# EAGLE schematic pneumatic_control (EAGLE 7.4.0)
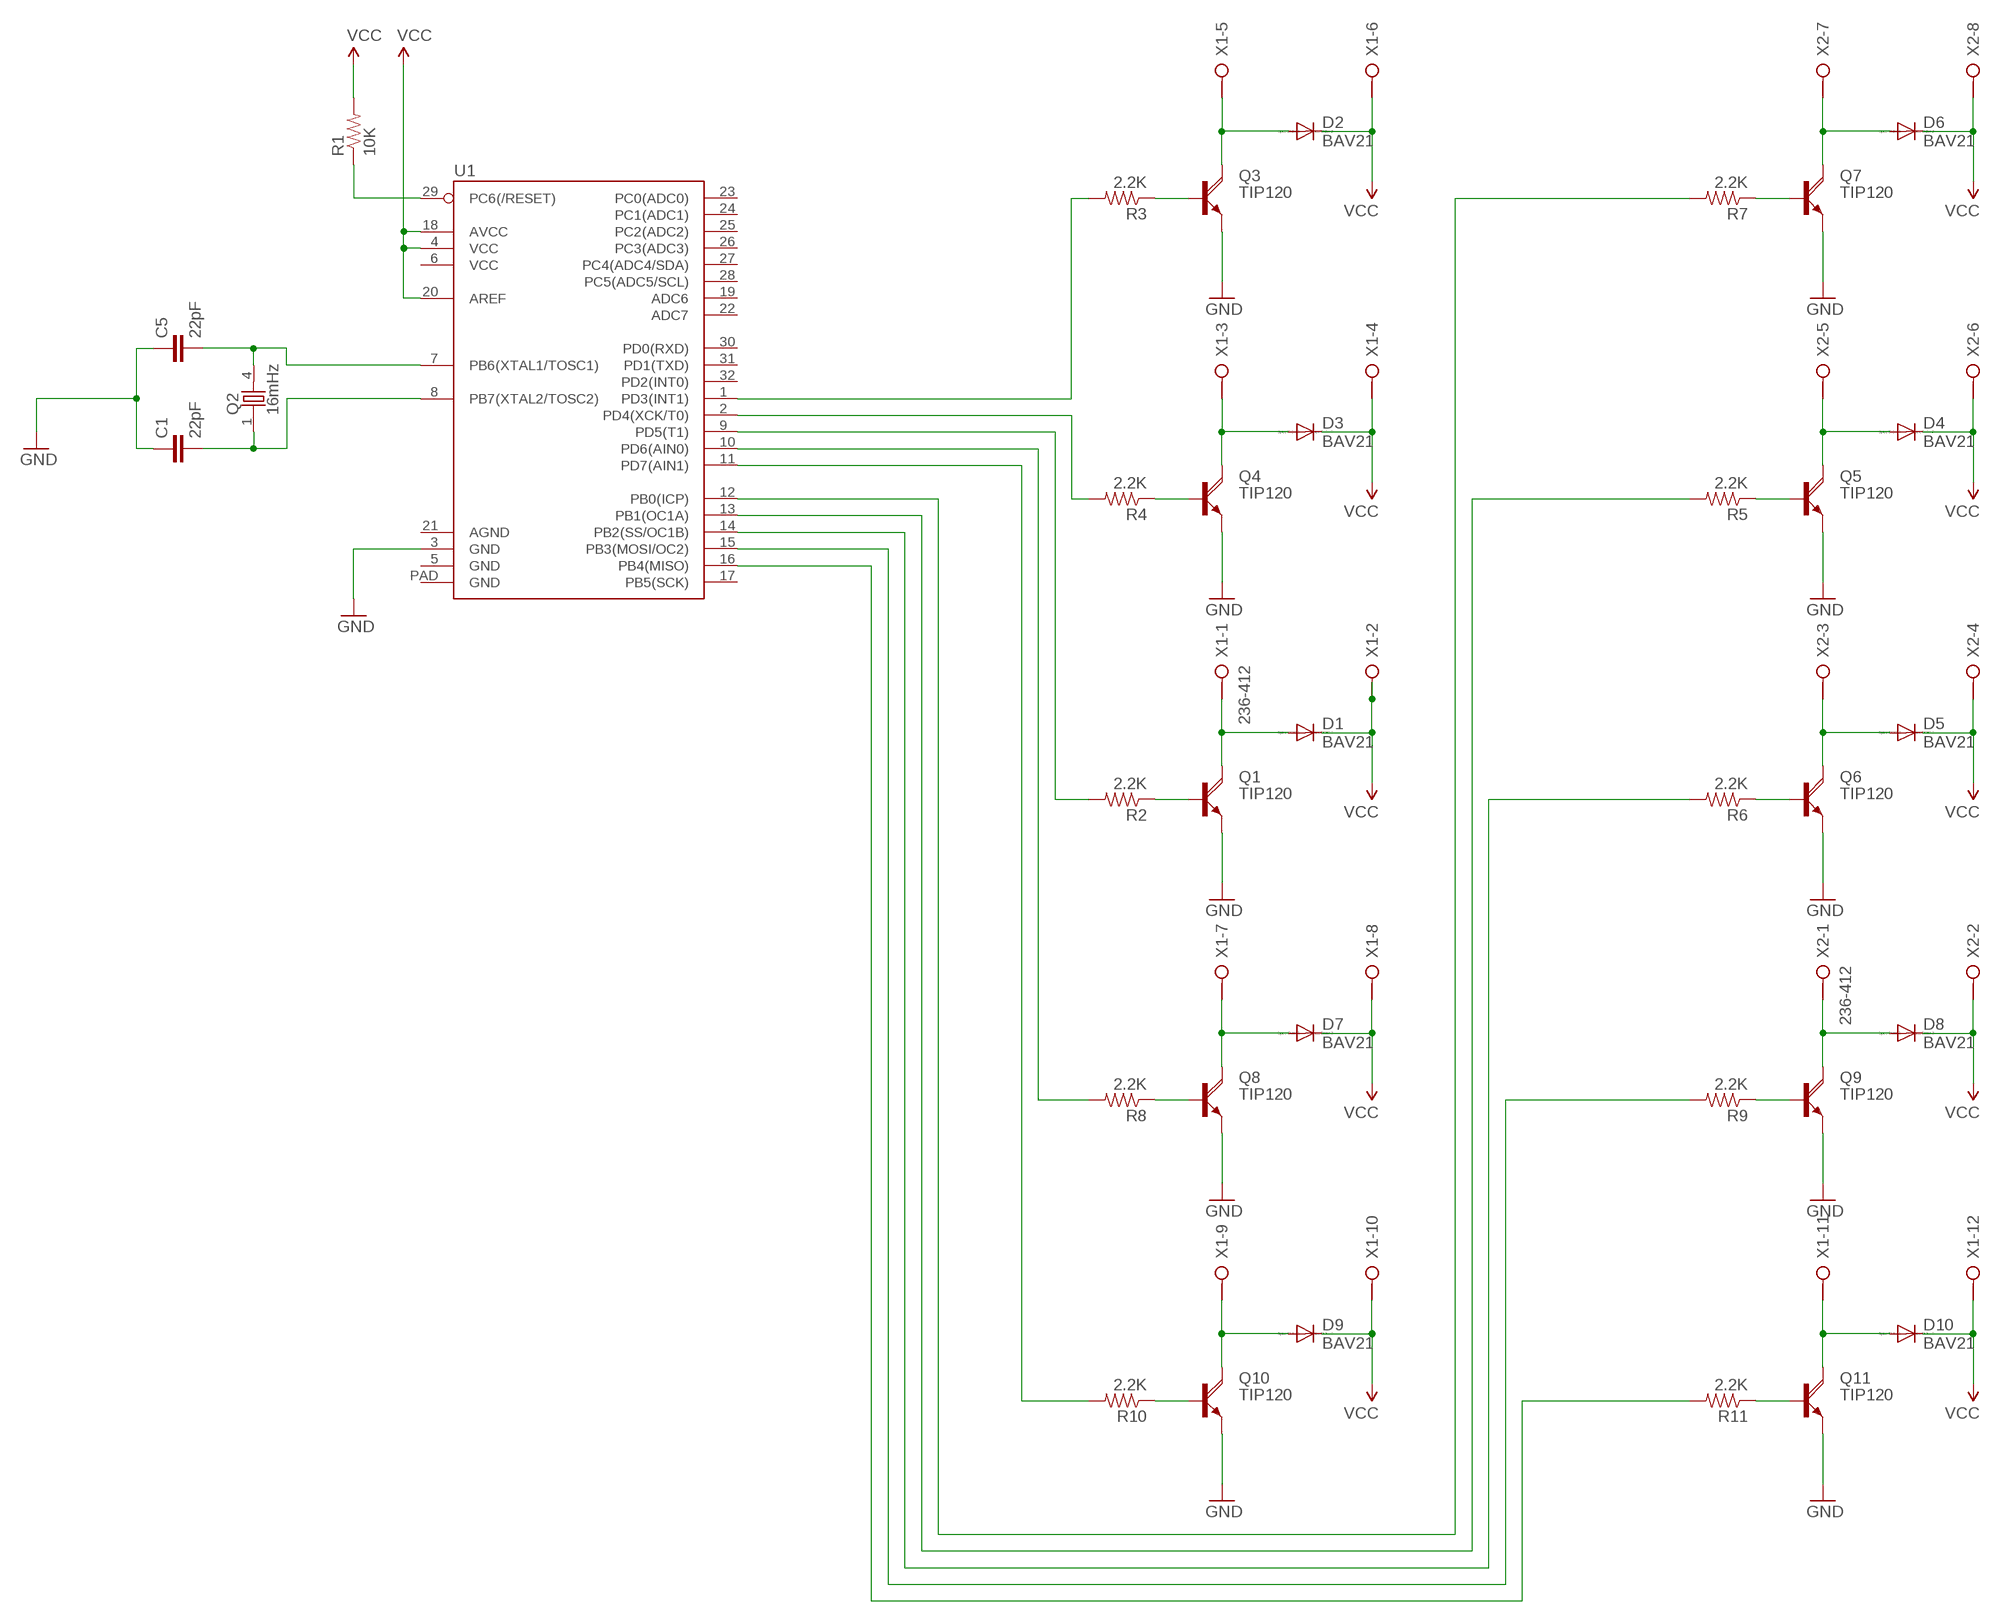
[diagram p0: schematic, sheet 1]

## Parts
C1  22pF  CAPPTH  [CAP-PTH-SMALL]
C5  22pF  CAPPTH  [CAP-PTH-SMALL]
D1  BAV21  [DO35-10]
D2  BAV21  [DO35-10]
D3  BAV21  [DO35-10]
D4  BAV21  [DO35-10]
D5  BAV21  [DO35-10]
D6  BAV21  [DO35-10]
D7  BAV21  [DO35-10]
D8  BAV21  [DO35-10]
D9  BAV21  [DO35-10]
D10  BAV21  [DO35-10]
Q1  TIP120  [TO220AH]
Q2  16mHz  86SMX  [86SMX]
Q3  TIP120  [TO220AH]
Q4  TIP120  [TO220AH]
Q5  TIP120  [TO220AH]
Q6  TIP120  [TO220AH]
Q7  TIP120  [TO220AH]
Q8  TIP120  [TO220AH]
Q9  TIP120  [TO220AH]
Q10  TIP120  [TO220AH]
Q11  TIP120  [TO220AH]
R1  10K  RESISTORPTH-1/4W  [AXIAL-0.4]
R2  2.2K  RESISTORPTH-1/4W  [AXIAL-0.4]
R3  2.2K  RESISTORPTH-1/4W  [AXIAL-0.4]
R4  2.2K  RESISTORPTH-1/4W  [AXIAL-0.4]
R5  2.2K  RESISTORPTH-1/4W  [AXIAL-0.4]
R6  2.2K  RESISTORPTH-1/4W  [AXIAL-0.4]
R7  2.2K  RESISTORPTH-1/4W  [AXIAL-0.4]
R8  2.2K  RESISTORPTH-1/4W  [AXIAL-0.4]
R9  2.2K  RESISTORPTH-1/4W  [AXIAL-0.4]
R10  2.2K  RESISTORPTH-1/4W  [AXIAL-0.4]
R11  2.2K  RESISTORPTH-1/4W  [AXIAL-0.4]
U1  ATMEGA328P_MLFMLF32  [MLF32-PAD]
X1  236-412  [236-412]
X2  236-412  [236-412]

## Nets
GND: C1.1 C5.1 Q1.E Q3.E Q4.E Q5.E Q6.E Q7.E Q8.E Q9.E Q10.E Q11.E U1.3(GND)
N$1: R1.P$1 U1.29(PC6(/RESET))
N$2: R2.P$2 U1.9(PD5(T1))
N$3: Q1.B R2.P$1
N$4: R3.P$2 U1.1(PD3(INT1))
N$5: Q3.B R3.P$1
N$6: R4.P$2 U1.2(PD4(XCK/T0))
N$7: Q4.B R4.P$1
N$9: Q5.B R5.P$1
N$10: R6.P$2 U1.14(PB2(SS/OC1B))
N$11: Q6.B R6.P$1
N$12: R7.P$2 U1.12(PB0(ICP))
N$13: Q7.B R7.P$1
N$14: C5.2 Q2.4
N$15: C1.2 Q2.1
N$16: R10.P$2 U1.11(PD7(AIN1))
N$17: Q8.B R8.P$1
N$18: R9.P$2 U1.15(PB3(MOSI/OC2))
N$19: Q9.B R9.P$1
N$21: Q10.B R10.P$1
N$22: R11.P$2 U1.16(PB4(MISO))
N$23: Q11.B R11.P$1
N$24: R8.P$2 U1.10(PD6(AIN0))
N$25: R5.P$2 U1.13(PB1(OC1A))
SNV(+): D1.A Q1.C X1.1@1(-1:KL1)
SNV(+)1: D2.A Q3.C X1.5@1(-5:KL1)
SNV(+)2: D3.A Q4.C X1.3@1(-3:KL1)
SNV(+)3: D4.A Q5.C X2.5@1(-5:KL1)
SNV(+)4: D5.A Q6.C X2.3@1(-3:KL1)
SNV(+)5: D6.A Q7.C X2.7@1(-7:KL1)
SNV(+)6: D7.A Q8.C X1.7@1(-7:KL1)
SNV(+)7: D8.A Q9.C X2.1@1(-1:KL1)
SNV(+)8: D9.A Q10.C X1.9@1(-9:KL1)
SNV(+)9: D10.A Q11.C X1.11@1(-11:KL1)
VCC: D1.C D2.C D3.C D4.C D5.C D6.C D7.C D8.C D9.C D10.C R1.P$2 U1.18(AVCC) U1.20(AREF) X1.2@1(-2:KL1) X1.2@2(-2:KL2) X1.4@1(-4:KL1) X1.6@1(-6:KL1) X1.8@1(-8:KL1) X1.10@1(-10:KL1) X1.12@1(-12:KL1) X2.2@1(-2:KL1) X2.4@1(-4:KL1) X2.6@1(-6:KL1) X2.8@1(-8:KL1)
Unconnected: U1.4(VCC) U1.5(GND) U1.6(VCC) U1.7(PB6(XTAL1/TOSC1)) U1.8(PB7(XTAL2/TOSC2)) U1.17(PB5(SCK)) U1.19(ADC6) U1.21(AGND) U1.22(ADC7) U1.23(PC0(ADC0)) U1.24(PC1(ADC1)) U1.25(PC2(ADC2)) U1.26(PC3(ADC3)) U1.27(PC4(ADC4/SDA)) U1.28(PC5(ADC5/SCL)) U1.30(PD0(RXD)) U1.31(PD1(TXD)) U1.32(PD2(INT0)) U1.PAD(GND) X1.1@2(-1:KL2) X1.3@2(-3:KL2) X1.4@2(-4:KL2) X1.5@2(-5:KL2) X1.6@2(-6:KL2) X1.7@2(-7:KL2) X1.8@2(-8:KL2) X1.9@2(-9:KL2) X1.10@2(-10:KL2) X1.11@2(-11:KL2) X1.12@2(-12:KL2) X2.1@2(-1:KL2) X2.2@2(-2:KL2) X2.3@2(-3:KL2) X2.4@2(-4:KL2) X2.5@2(-5:KL2) X2.6@2(-6:KL2) X2.7@2(-7:KL2) X2.8@2(-8:KL2) X2.9@1(-9:KL1) X2.9@2(-9:KL2) X2.10@1(-10:KL1) X2.10@2(-10:KL2) X2.11@1(-11:KL1) X2.11@2(-11:KL2) X2.12@1(-12:KL1) X2.12@2(-12:KL2)

## Library data of the parts
C1 C5 = SparkFun-Capacitors:CAP: Capacitor Standard 0603 ceramic capacitor, and 0.1" leaded capacitor.
D1-D10 = diode:BAV21: DIODE high-voltage general purpose diode
Q1 Q3-Q11 = transistor-power:TIP120: NPN DARLINGTON TRANSISTOR
Q2 = crystal:86SMX: CRYSTAL; MF: C-MAC FREQUENCY PRODUCTS LTD; MPN: XTAL003321- 86SMX; OC_FARNELL: 6344914; OC_NEWARK: 01H9866
R1-R11 = SparkFun-Passives:RESISTOR: Resistor Basic schematic elements and footprints for 0603, 1206, and PTH resistors.
U1 = SparkFun-DigitalIC:ATMEGA328P_MLF: 32-Pin Atmega328 part Commonly used on Arduino compatible boards Available in QFP and QFN packages TQFP is IC-09069 QFN is non-stock
X1 X2 = con-wago-508:236-412: Terminal Strips 2.5 mm2/AWG 12, Series 236, Pin Spacings 5/5.08 mm Source: Data sheet <http://www.farnell.com/datasheets/63479.pdf>; MF: Wago Corporation; MPN: 0236-0412; OC_FARNELL: 1283531; OC_NEWARK: 79K2064